# Altium schematic sheet 2_Power.SchDoc
size A4; SheetNumber: 3; SheetTotal: 7
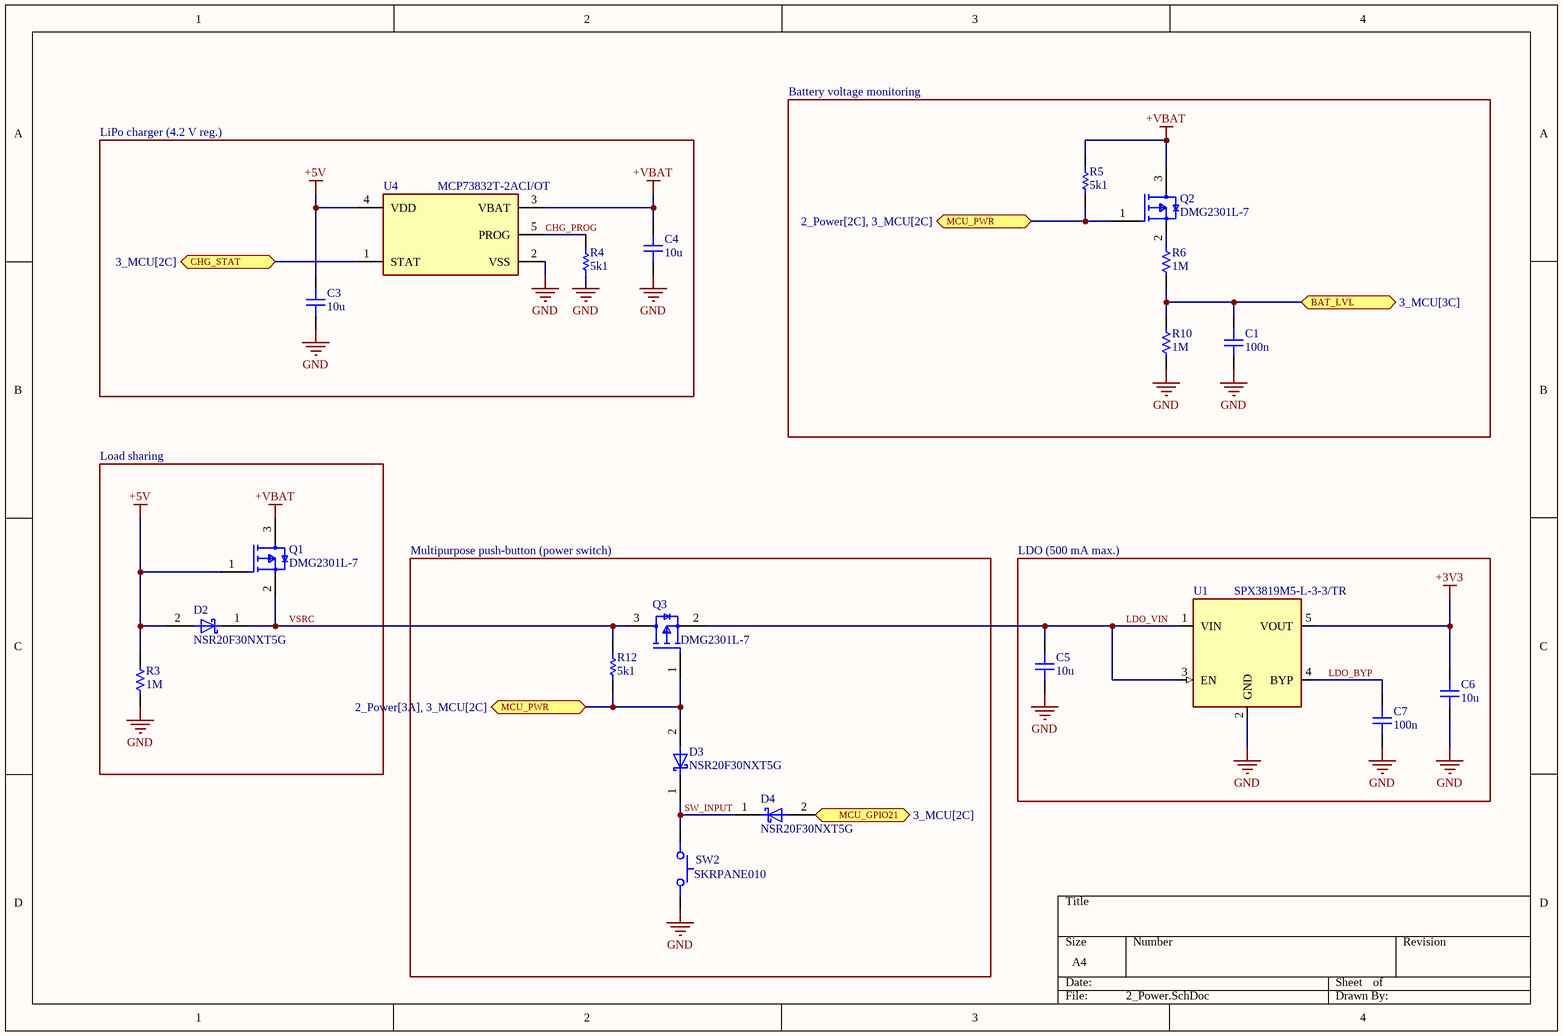
[diagram p0: 2_Power.SchDoc]

## Parts
C1  100n  [CAP_0402]
C3  10u  [CAP_0402]
C4  10u  [CAP_0402]
C5  10u  [CAP_0402]
C6  10u  [CAP_0402]
C7  100n  [CAP_0402]
D2  NSR20F30NXT5G  [ONSC-DSN-2-512AB-01_V]
D3  NSR20F30NXT5G  [ONSC-DSN-2-512AB-01_V]
D4  NSR20F30NXT5G  [ONSC-DSN-2-512AB-01_V]
Q1  DMG2301L-7  [FP-SOT23-MFG]
Q2  DMG2301L-7  [FP-SOT23-MFG]
Q3  DMG2301L-7  [FP-SOT23-MFG]
R3  1M  [RES_0402]
R4  5k1  [RESC1005X40X25ML10T10]
R5  5k1  [RESC1005X40X25ML10T10]
R6  1M  [RES_0402]
R10  1M  [RES_0402]
R12  5k1  [RESC1005X40X25ML10T10]
SW2  SKRPANE010  [SKRPANE010]
U1  SPX3819M5-L-3-3/TR  [SOT-23-5]
U4  MCP73832T-2ACI/OT  [FP-C04-091-OT-MFG]

## Blocks framed on the sheet
Battery voltage monitoring: C1 Q2 R5 R6 R10
LiPo charger (4.2 V reg.): C3 C4 R4 U4
Load sharing: D2 Q1 R3
Multipurpose push-button (power switch): D3 D4 Q3 R12 SW2
LDO (500 mA max.): C5-C7 U1

## Ports
BAT_LVL (bidir, see 3_MCU[3C]), CHG_STAT (bidir, see 3_MCU[2C]), MCU_GPIO21 (bidir, see 3_MCU[2C]), MCU_PWR (bidir, see 2_Power[2C], 3_MCU[2C]), MCU_PWR (bidir, see 2_Power[3A], 3_MCU[2C])

## Nets
+3V3: C6.2 U1.5(VOUT)
+5V: C3.2 D2.2(A) Q1.1(G) R3.2 U4.4(VDD)
+VBAT: C4.2 Q1.3(D) Q2.3(D) R5.2 U4.3(VBAT)
GND: C1.1 C3.1 C4.1 C5.1 C6.1 C7.1 R3.1 R4.1 R10.1 SW2.12 U1.2(GND) U4.2(VSS)
BAT_LVL: C1.2 R6.1 R10.2 ; port BAT_LVL
CHG_PROG: R4.2 U4.5(PROG)
CHG_STAT: U4.1(STAT) ; port CHG_STAT
LDO_BYP: C7.2 U1.4(BYP)
LDO_VIN: C5.2 Q3.2(S) U1.1(VIN) U1.3(EN)
MCU_GPIO21: D4.2(A) ; port MCU_GPIO21
MCU_PWR: D3.2(A) Q2.1(G) Q3.1(G) R5.1 R12.1 ; port MCU_PWR
SW_INPUT: D3.1(K) D4.1(K) SW2.34
VSRC: D2.1(K) Q1.2(S) Q3.3(D) R12.2
NetQ2_2: Q2.2(S) R6.2

## Library data of the parts
C1 C7 = CAP_0402_16V: Capacitor SMD 0402 16V; Supplier 1: Mouser; Supplier Part Number 1: 187-CL05A104KP5NNND
C3-C6 = CAP_0402_10V: Capacitor SMD 0402 10V; Supplier 1: Arrow Electronics; Supplier Part Number 1: GRM155R61A106ME11D
D2-D4 = ONSC_D_SCHOTTKY_0603-4: Rectifier Diode, Schottky, 1 Phase, 1 Element, 2A, 30V V(RRM), Silicon; Forward Voltage: 420mV; Qualification Status: Not Qualified; Number of Elements: 1; Application(s): EFFICIENCY; Non-rep Pk Forward Current-Max: 28A; Max Power Dissipation: 1.56W; Case Connection: ANODE; Reach SVHC Compliant: Yes; Diode Element Material: SILICON; Pins: 2; RoHS Compliant: Yes; Rep Pk Reverse Voltage-Max: 30V; Technology: SCHOTTKY; Terminal Position: BOTTOM; Surface Mount: Yes; Max Operating Temperature: 150°C; Package Shape: Rectangular; Diode Type: RECTIFIER; Number of Phases: 1; Terminal Form: No Lead; Max Output current: 2A; Package Style: CHIP CARRIERMeter
Q1-Q3 = CMP-12801-000065-1: MOSFET P-CH 20V 3A SOT23; Manufacturer: Diodes Inc.; Number Of Channels: 1; Turn On Delay Time: 5ns; Drain To Source Resistance: 120mΩ; Max Junction Temp: +150°C; Gate To Source Voltage: 8V; Power Dissipation: 1.5W; Rthja Max: 83°C/W; Max Forward Diode Voltage: -1.2V; Standoff Height: 0.013mm; Threshold Vgs Min: -0.4V; Input Capacitace At Vds: 476pF @ -10V; Depletion Mode: False; Gate Charge At Vgs: 5.5nC @ -4.5V; Pulse Drain Current: -10A; Drain To Source Voltage: -20V; Continuous Drain Current: -3A; Turn Off Delay Time: 30ns; Lead Free: Yes; Package: SOT23; ComponentLink2Description: Datasheet; Device Class L3: MOSFETs; Device Class L1: Discrete Semiconductors; Manufacturer Part Number: DMG2301L-7; Automotive: No; Height: 1.1mm; Category: Trans; Temperature Range High: +150°C; Digikey Description: MOSFET P-CH 20V 3A SOT23; RoHS: TRUE; Number Of P Channels: 1; Footprint Url: https://www.diodes.com/assets/Package-Files/SOT23.pdf; Octopart: https://octopart.com/dmg2301l-7-diodes+inc.-67250456; ComponentLink2URL: https://www.diodes.com/assets/Datasheets/DMG2301L.pdf; Mouser Description: Single P-Channel 20 V 1.5 W 5.5 nC Silicon Surface Mount Mosfet - SOT-23; Drain To Source Breakdown Voltage: -20V; Threshold Vgs Max: -1.2V; Device Class L2: Transistors; Temperature: -55°C to +150°C; Temperature Range Low: -55°C
R3 R6 R10 = RES_0402: Resistor SMD 0402; Manufacturer: *; Manufacturer Part Number: *; Distributor Link: *; Supplier 1: Mouser; Supplier Part Number 1: 71-CRCW04021M00FKEDC
R4 R5 R12 = CMP-2002-03675-1: Part Number: RK73B1ETTP512J; Manufacturer: KOA Speer
SW2 = SKRPANE010: Tactile Switch SMD SPST; Manufacturer: Alps Alpine; Manufacturer Part Number: SKRPANE010; Supplier 1: Mouser; Supplier Part Number 1: 688-SKRPANE010
U1 = SPX3819M5-L-3-3/TR: 500mA +3.3V Low-Noise LDO Voltage Regulator; Manufacturer: MaxLinear; Manufacturer Part Number: SPX3819M5-L-3-3/TR
U4 = CMP-0133-00138-2: IC LI-ION/LI-POLY CTRLR SOT23-5; Output Current: 10mA; Output Voltage: 4.2V; Max Output Current: 500mA; Max Power Dissipation: 1.54W; Min Output Voltage: 4.168V; Number of Channels: 1; Max Supply Voltage: 6V; Min Supply Voltage: 3.75V; Max Output Voltage: 4.5V; Case/Package: SOT-23; Lead Free: Lead Free; Termination: SMD/SMT; Min Operating Temperature: -40°C; Max Operating Temperature: 85°C; Height: 1.3mm; Length: 3.1mm; Mount: Surface Mount; Package Quantity: 3000; Number of Pins: 5; Packaging: Tape and Reel; REACH SVHC: No SVHC; Contact Plating: Tin; Width: 1.8mm; Number of Cells: 1; Number of Outputs: 1; Power Dissipation: 1.54W; Max Charge Current: 500mA; Max Input Voltage: 6V; Radiation Hardening: No